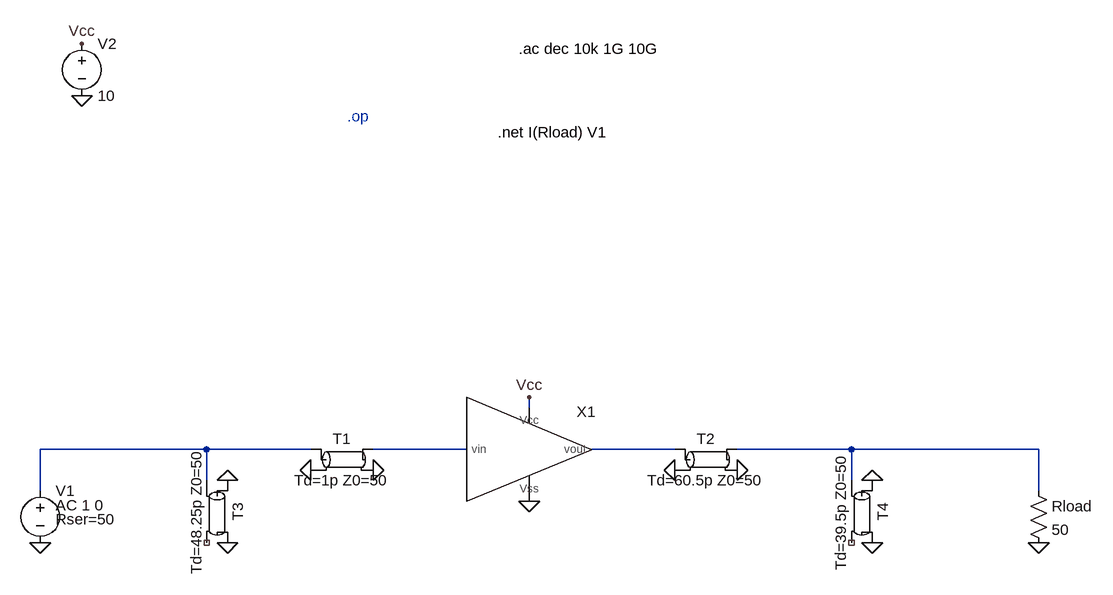
[diagram p0: schematic Draft1.asc]
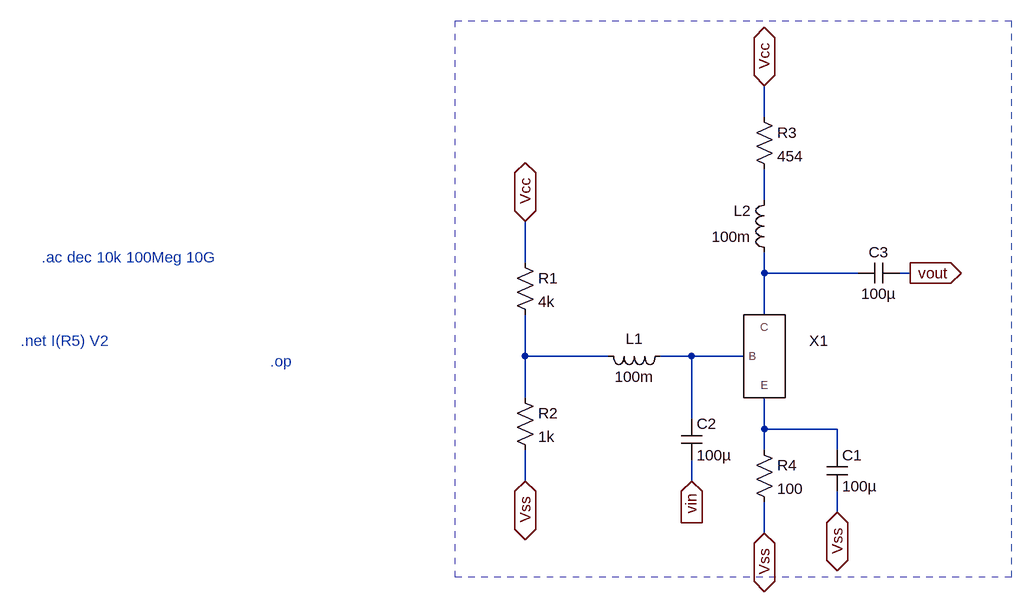
[diagram p1: sub-circuit ue.asc]
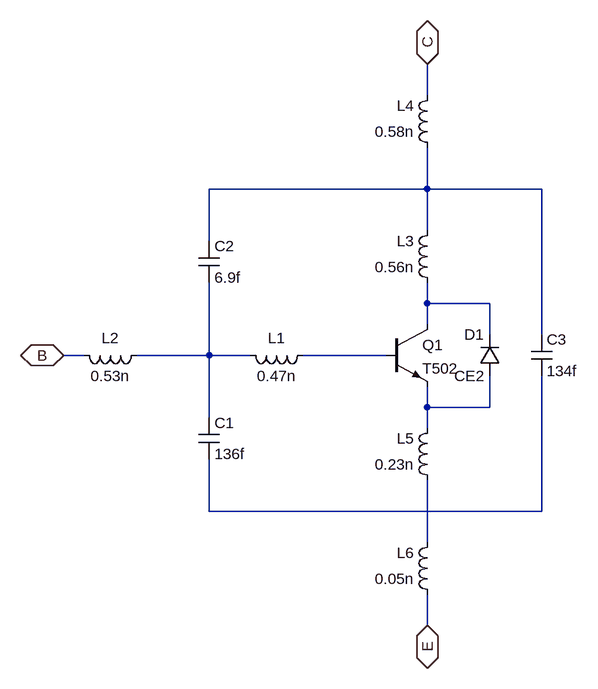
[diagram p2: sub-circuit transistorreal.asc]
Draft1.asc, the LTspice schematic file:
Version 4
SHEET 1 1568 720
WIRE 704 -16 704 -32
WIRE 208 48 -48 48
WIRE 368 48 208 48
WIRE 608 48 464 48
WIRE 928 48 800 48
WIRE 1200 48 1024 48
WIRE 1488 48 1200 48
WIRE 208 96 208 48
WIRE 1200 96 1200 48
WIRE -48 112 -48 48
WIRE 1488 112 1488 48
WIRE 704 128 704 112
FLAG -48 192 0
FLAG 1488 192 0
FLAG 704 128 0
FLAG 240 96 0
FLAG 240 192 0
FLAG 1232 96 0
FLAG 1232 192 0
FLAG 368 80 0
FLAG 464 80 0
FLAG 928 80 0
FLAG 1024 80 0
FLAG 16 -496 0
FLAG 16 -576 Vcc
FLAG 704 -32 Vcc
SYMBOL Voltage -48 96 R0
WINDOW 123 24 38 Left 2
WINDOW 39 24 60 Left 2
SYMATTR Value2 AC 1 0
SYMATTR SpiceLine Rser=50
SYMATTR InstName V1
SYMATTR Value ""
SYMBOL Res 1472 96 R0
SYMATTR InstName Rload
SYMATTR Value 50
SYMBOL ue 688 48 R0
SYMATTR InstName X1
SYMBOL tline 416 64 R0
SYMATTR InstName T1
SYMATTR Value Td=1p Z0=50
SYMBOL tline 976 64 R0
SYMATTR InstName T2
SYMATTR Value Td=60.5p Z0=50
SYMBOL tline 224 144 R90
SYMATTR InstName T3
SYMATTR Value Td=48.25p Z0=50
SYMBOL tline 1216 144 R90
SYMATTR InstName T4
SYMATTR Value Td=39.5p Z0=50
SYMBOL Voltage 16 -592 R0
SYMATTR InstName V2
SYMATTR Value 10
TEXT 688 -568 Left 2 !.ac dec 10k 1G 10G
TEXT 656 -440 Left 2 !.net I(Rload) V1
TEXT 424 -464 Left 2 ;.op

ue.asc, the sub-circuit schematic file:
Version 4
SHEET 1 880 680
WIRE 368 -64 368 -112
WIRE 368 64 368 16
WIRE 0 160 0 96
WIRE 368 176 368 144
WIRE 512 176 368 176
WIRE 592 176 576 176
WIRE 368 240 368 176
WIRE 0 304 0 240
WIRE 128 304 0 304
WIRE 256 304 208 304
WIRE 336 304 256 304
WIRE 0 368 0 304
WIRE 256 400 256 304
WIRE 368 416 368 368
WIRE 480 416 368 416
WIRE 368 448 368 416
WIRE 480 448 480 416
WIRE 0 496 0 448
WIRE 256 496 256 464
WIRE 480 544 480 512
WIRE 368 576 368 528
FLAG 0 96 Vcc
IOPIN 0 96 BiDir
FLAG 368 -112 Vcc
IOPIN 368 -112 BiDir
FLAG 256 496 vin
IOPIN 256 496 In
FLAG 592 176 vout
IOPIN 592 176 Out
FLAG 0 496 Vss
IOPIN 0 496 BiDir
FLAG 368 576 Vss
IOPIN 368 576 BiDir
FLAG 480 544 Vss
IOPIN 480 544 BiDir
SYMBOL TransistorReal 352 288 R0
SYMATTR InstName X1
SYMBOL ind 224 288 R90
WINDOW 0 5 56 VBottom 2
WINDOW 3 32 56 VTop 2
SYMATTR InstName L1
SYMATTR Value 100m
SYMBOL ind 384 160 R180
WINDOW 0 36 80 Left 2
WINDOW 3 36 40 Left 2
SYMATTR InstName L2
SYMATTR Value 100m
SYMBOL Res 352 432 R0
SYMATTR InstName R4
SYMATTR Value 100
SYMBOL Res 352 -80 R0
SYMATTR InstName R3
SYMATTR Value 454
SYMBOL Res -16 144 R0
SYMATTR InstName R1
SYMATTR Value 4k
SYMBOL Res -16 352 R0
SYMATTR InstName R2
SYMATTR Value 1k
SYMBOL Cap 464 448 R0
SYMATTR InstName C1
SYMATTR Value 100µ
SYMBOL Cap 240 400 R0
SYMATTR InstName C2
SYMATTR Value 100µ
SYMBOL Cap 576 160 R90
WINDOW 0 0 32 VBottom 2
WINDOW 3 32 32 VTop 2
SYMATTR InstName C3
SYMATTR Value 100µ
TEXT -392 312 Left 2 ;.op
TEXT -744 152 Left 2 ;.ac dec 10k 100Meg 10G
TEXT -776 280 Left 2 ;.net I(R5) V2
RECTANGLE Normal -108 -212 748 644 2

transistorreal.asc, the sub-circuit schematic file:
Version 4
SHEET 1 880 872
WIRE 448 -16 448 -64
WIRE 448 128 448 64
WIRE 448 128 112 128
WIRE 624 128 448 128
WIRE 448 192 448 128
WIRE 112 208 112 128
WIRE 448 304 448 272
WIRE 544 304 448 304
WIRE 448 336 448 304
WIRE 544 352 544 304
WIRE 624 352 624 128
WIRE -80 384 -112 384
WIRE 112 384 112 272
WIRE 112 384 0 384
WIRE 176 384 112 384
WIRE 384 384 256 384
WIRE 448 464 448 432
WIRE 544 464 544 416
WIRE 544 464 448 464
WIRE 112 480 112 384
WIRE 448 496 448 464
WIRE 112 624 112 544
WIRE 624 624 624 416
WIRE 624 624 112 624
WIRE 448 672 448 576
WIRE 448 800 448 752
FLAG -112 384 B
IOPIN -112 384 BiDir
FLAG 448 -64 C
IOPIN 448 -64 BiDir
FLAG 448 800 E
IOPIN 448 800 BiDir
SYMBOL npn 384 336 R0
SYMATTR InstName Q1
SYMATTR Value T502
SYMBOL ind 272 368 R90
WINDOW 0 5 56 VBottom 2
WINDOW 3 32 56 VTop 2
SYMATTR InstName L1
SYMATTR Value 0.47n
SYMBOL ind 16 368 R90
WINDOW 0 5 56 VBottom 2
WINDOW 3 32 56 VTop 2
SYMATTR InstName L2
SYMATTR Value 0.53n
SYMBOL ind 464 288 R180
WINDOW 0 36 80 Left 2
WINDOW 3 36 40 Left 2
SYMATTR InstName L3
SYMATTR Value 0.56n
SYMBOL ind 464 80 R180
WINDOW 0 36 80 Left 2
WINDOW 3 36 40 Left 2
SYMATTR InstName L4
SYMATTR Value 0.58n
SYMBOL ind 464 592 R180
WINDOW 0 36 80 Left 2
WINDOW 3 36 40 Left 2
SYMATTR InstName L5
SYMATTR Value 0.23n
SYMBOL ind 464 768 R180
WINDOW 0 36 80 Left 2
WINDOW 3 36 40 Left 2
SYMATTR InstName L6
SYMATTR Value 0.05n
SYMBOL Cap 96 480 R0
SYMATTR InstName C1
SYMATTR Value 136f
SYMBOL Cap 96 208 R0
SYMATTR InstName C2
SYMATTR Value 6.9f
SYMBOL Cap 608 352 R0
SYMATTR InstName C3
SYMATTR Value 134f
SYMBOL Diode 560 416 R180
WINDOW 0 24 64 Left 2
WINDOW 3 24 0 Left 2
SYMATTR InstName D1
SYMATTR Value CE2

The netlist it stands for:
* Draft1.asc
V1 N001 0 AC 1 0 Rser=50
Rload N004 0 50
XX1 N002 Vcc N003 0 ue
T1 N001 0 N002 0 Td=1p Z0=50
T2 N003 0 N004 0 Td=60.5p Z0=50
T3 0 N001 0 NC_01 Td=48.25p Z0=50
T4 0 N004 0 NC_02 Td=39.5p Z0=50
V2 Vcc 0 10

* block symbol definitions
.subckt ue vin Vcc vout Vss
XX1 N004 N002 N005 transistorreal
L1 N004 N003 100m
L2 N002 N001 100m
R4 N005 Vss 100
R3 Vcc N001 454
R1 Vcc N003 4k
R2 N003 Vss 1k
C1 N005 Vss 100µ
C2 N004 vin 100µ
C3 vout N002 100µ
* .op
* .ac dec 10k 100Meg 10G
* .net I(R5) V2
.ends ue

.subckt transistorreal B C E
Q1 N002 N004 N005 0 T502
L1 N004 N003 0.47n
L2 N003 B 0.53n
L3 N002 N001 0.56n
L4 N001 C 0.58n
L5 N007 N005 0.23n
L6 E N007 0.05n
C1 N003 N006 136f
C2 N001 N003 6.9f
C3 N001 N006 134f
D1 N005 N002 CE2
.ends transistorreal

.model D D
.lib standard.dio
.model NPN NPN
.model PNP PNP
.lib standard.bjt
.ac dec 10k 1G 10G
.net I(Rload) V1
* .op
.backanno
.end